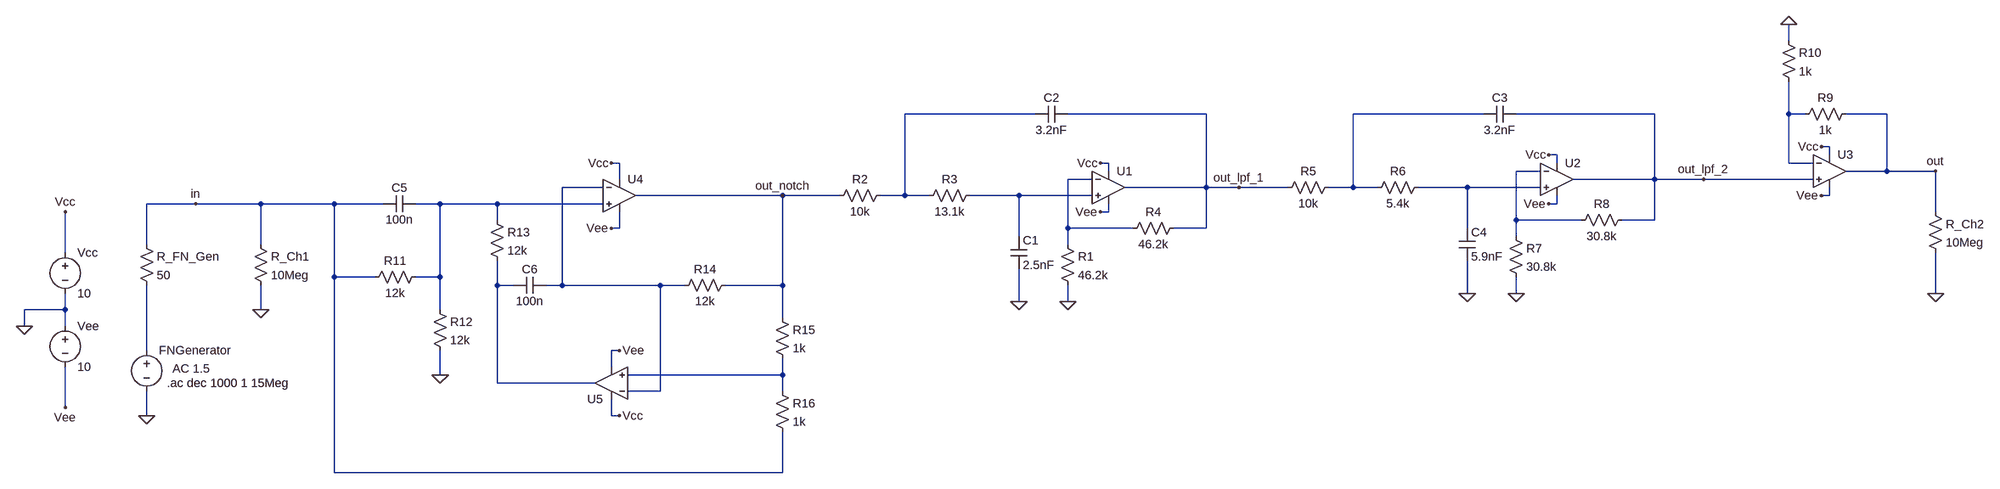
[diagram p0: schematic Mic-Filter.asc]
Mic-Filter.asc, the LTspice schematic file:
Version 4
SHEET 1 2580 680
WIRE 2192 -176 2192 -208
WIRE 656 -32 400 -32
WIRE 992 -32 720 -32
WIRE 1536 -32 1280 -32
WIRE 1872 -32 1600 -32
WIRE 2192 -32 2192 -96
WIRE 2224 -32 2192 -32
WIRE 2384 -32 2304 -32
WIRE 2272 32 2256 32
WIRE 1680 48 1664 48
WIRE 2272 48 2272 32
WIRE -160 64 -176 64
WIRE 800 64 784 64
WIRE 1680 64 1680 48
WIRE 2192 64 2192 -32
WIRE 2240 64 2192 64
WIRE 800 80 800 64
WIRE 1648 80 1600 80
WIRE 2384 80 2384 -32
WIRE 2384 80 2304 80
WIRE 2480 80 2384 80
WIRE -160 96 -160 64
WIRE 768 96 720 96
WIRE 1872 96 1872 -32
WIRE 1872 96 1712 96
WIRE 1968 96 1872 96
WIRE 2240 96 1968 96
WIRE -192 112 -272 112
WIRE 992 112 992 -32
WIRE 992 112 832 112
WIRE 1056 112 992 112
WIRE 1152 112 1056 112
WIRE 1280 112 1280 -32
WIRE 1280 112 1232 112
WIRE 1328 112 1280 112
WIRE 1504 112 1408 112
WIRE 1648 112 1504 112
WIRE 160 128 -128 128
WIRE 272 128 160 128
WIRE 400 128 400 -32
WIRE 400 128 352 128
WIRE 448 128 400 128
WIRE 624 128 528 128
WIRE 768 128 624 128
WIRE 2272 128 2272 112
WIRE 2272 128 2256 128
WIRE -992 144 -1088 144
WIRE -864 144 -992 144
WIRE -720 144 -864 144
WIRE -624 144 -720 144
WIRE -512 144 -560 144
WIRE -400 144 -512 144
WIRE -192 144 -400 144
WIRE 1680 144 1680 128
WIRE 1680 144 1664 144
WIRE 800 160 800 144
WIRE 800 160 784 160
WIRE 2480 160 2480 80
WIRE -400 176 -400 144
WIRE 1600 176 1600 80
WIRE 1728 176 1600 176
WIRE 1872 176 1872 96
WIRE 1872 176 1808 176
WIRE -160 192 -160 160
WIRE -160 192 -176 192
WIRE 720 192 720 96
WIRE 848 192 720 192
WIRE 992 192 992 112
WIRE 992 192 928 192
WIRE 1504 192 1504 112
WIRE 624 208 624 128
WIRE 1600 208 1600 176
WIRE -1088 224 -1088 144
WIRE -864 224 -864 144
WIRE 720 224 720 192
WIRE -1248 240 -1248 160
WIRE -720 288 -720 144
WIRE -640 288 -720 288
WIRE -512 288 -512 144
WIRE -512 288 -560 288
WIRE -400 304 -400 256
WIRE -368 304 -400 304
WIRE -272 304 -272 112
WIRE -272 304 -304 304
WIRE -80 304 -272 304
WIRE -32 304 -80 304
WIRE 160 304 160 128
WIRE 160 304 48 304
WIRE 1504 320 1504 256
WIRE 1600 320 1600 288
WIRE 2480 320 2480 240
WIRE 624 336 624 272
WIRE 720 336 720 304
WIRE -1248 352 -1248 320
WIRE -1248 352 -1328 352
WIRE -864 352 -864 304
WIRE -512 352 -512 288
WIRE 160 368 160 304
WIRE -1328 384 -1328 352
WIRE -1248 384 -1248 352
WIRE -1088 432 -1088 304
WIRE -160 432 -176 432
WIRE -176 464 -176 432
WIRE -512 480 -512 432
WIRE 160 480 160 448
WIRE 160 480 -144 480
WIRE -400 496 -400 304
WIRE -208 496 -400 496
WIRE -80 512 -80 304
WIRE -80 512 -144 512
WIRE 160 512 160 480
WIRE -1248 544 -1248 464
WIRE -1088 560 -1088 512
WIRE -176 560 -176 528
WIRE -160 560 -176 560
WIRE -720 672 -720 288
WIRE 160 672 160 592
WIRE 160 672 -720 672
FLAG -1088 560 0
FLAG -864 352 0
FLAG -992 144 in
FLAG 624 336 0
FLAG 720 336 0
FLAG -1328 384 0
FLAG -1248 544 Vee
FLAG -1248 160 Vcc
FLAG 784 160 Vee
FLAG 784 64 Vcc
FLAG 1056 112 out_lpf_1
FLAG 1600 320 0
FLAG 1664 144 Vee
FLAG 1664 48 Vcc
FLAG 1504 320 0
FLAG 1968 96 out_lpf_2
FLAG 2256 128 Vee
FLAG 2256 32 Vcc
FLAG 2480 320 0
FLAG 2192 -208 0
FLAG 2480 80 out
FLAG -512 480 0
FLAG -176 64 Vcc
FLAG -176 192 Vee
FLAG -160 560 Vcc
FLAG -160 432 Vee
FLAG 160 128 out_notch
SYMBOL res -1104 208 R0
SYMATTR InstName R_FN_Gen
SYMATTR Value 50
SYMBOL voltage -1088 416 R0
WINDOW 123 51 52 Left 2
WINDOW 39 0 0 Left 0
SYMATTR Value2 AC 1.5
SYMATTR InstName FNGenerator
SYMATTR Value ""
SYMBOL res -880 208 R0
SYMATTR InstName R_Ch1
SYMATTR Value 10Meg
SYMBOL res 368 112 R90
WINDOW 0 0 56 VBottom 2
WINDOW 3 32 56 VTop 2
SYMATTR InstName R2
SYMATTR Value 10k
SYMBOL res 544 112 R90
WINDOW 0 0 56 VBottom 2
WINDOW 3 32 56 VTop 2
SYMATTR InstName R3
SYMATTR Value 13.1k
SYMBOL OpAmps\\UniversalOpamp2 800 112 R0
SYMATTR InstName U1
SYMBOL cap 608 208 R0
SYMATTR InstName C1
SYMATTR Value 2.5nF
SYMBOL cap 720 -48 R90
WINDOW 0 0 32 VBottom 2
WINDOW 3 32 32 VTop 2
SYMATTR InstName C2
SYMATTR Value 3.2nF
SYMBOL res 704 208 R0
SYMATTR InstName R1
SYMATTR Value 46.2k
SYMBOL voltage -1248 368 R0
WINDOW 123 0 0 Left 0
WINDOW 39 0 0 Left 0
SYMATTR InstName Vee
SYMATTR Value 10
SYMBOL res 944 176 R90
WINDOW 0 0 56 VBottom 2
WINDOW 3 32 56 VTop 2
SYMATTR InstName R4
SYMATTR Value 46.2k
SYMBOL res 1248 96 R90
WINDOW 0 0 56 VBottom 2
WINDOW 3 32 56 VTop 2
SYMATTR InstName R5
SYMATTR Value 10k
SYMBOL res 1424 96 R90
WINDOW 0 0 56 VBottom 2
WINDOW 3 32 56 VTop 2
SYMATTR InstName R6
SYMATTR Value 5.4k
SYMBOL cap 1600 -48 R90
WINDOW 0 0 32 VBottom 2
WINDOW 3 32 32 VTop 2
SYMATTR InstName C3
SYMATTR Value 3.2nF
SYMBOL OpAmps\\UniversalOpamp2 1680 96 R0
SYMATTR InstName U2
SYMBOL res 1584 192 R0
SYMATTR InstName R7
SYMATTR Value 30.8k
SYMBOL res 1824 160 R90
WINDOW 0 0 56 VBottom 2
WINDOW 3 32 56 VTop 2
SYMATTR InstName R8
SYMATTR Value 30.8k
SYMBOL cap 1488 192 R0
SYMATTR InstName C4
SYMATTR Value 5.9nF
SYMBOL OpAmps\\UniversalOpamp2 2272 80 R0
SYMATTR InstName U3
SYMBOL res 2320 -48 R90
WINDOW 0 0 56 VBottom 2
WINDOW 3 32 56 VTop 2
SYMATTR InstName R9
SYMATTR Value 1k
SYMBOL res 2176 -192 R0
SYMATTR InstName R10
SYMATTR Value 1k
SYMBOL res 2464 144 R0
SYMATTR InstName R_Ch2
SYMATTR Value 10Meg
SYMBOL voltage -1248 224 R0
SYMATTR InstName Vcc
SYMATTR Value 10
SYMBOL cap -560 128 R90
WINDOW 0 0 32 VBottom 2
WINDOW 3 32 32 VTop 2
SYMATTR InstName C5
SYMATTR Value 100n
SYMBOL res -544 272 R90
WINDOW 0 0 56 VBottom 2
WINDOW 3 32 56 VTop 2
SYMATTR InstName R11
SYMATTR Value 12k
SYMBOL res -528 336 R0
SYMATTR InstName R12
SYMATTR Value 12k
SYMBOL res -416 160 R0
SYMATTR InstName R13
SYMATTR Value 12k
SYMBOL OpAmps\\UniversalOpamp2 -160 128 R0
SYMATTR InstName U4
SYMBOL res 64 288 R90
WINDOW 0 0 56 VBottom 2
WINDOW 3 32 56 VTop 2
SYMATTR InstName R14
SYMATTR Value 12k
SYMBOL res 144 352 R0
SYMATTR InstName R15
SYMATTR Value 1k
SYMBOL res 144 496 R0
SYMATTR InstName R16
SYMATTR Value 1k
SYMBOL cap -304 288 R90
WINDOW 0 0 32 VBottom 2
WINDOW 3 32 32 VTop 2
SYMATTR InstName C6
SYMATTR Value 100n
SYMBOL OpAmps\\UniversalOpamp2 -176 496 R180
SYMATTR InstName U5
TEXT -1048 496 Left 2 !.ac dec 1000 1 15Meg

The netlist it stands for:
* Mic-Filter.asc
R_FN_Gen in N011 50
V§FNGenerator N011 0 AC 1.5
R_Ch1 in 0 10Meg
R2 N001 out_notch 10k
R3 N008 N001 13.1k
XU1 N008 N005 Vcc Vee out_lpf_1 level.2 Avol=1Meg GBW=10Meg Slew=10Meg ilimit=25m rail=0 Vos=0 phimargin=45 en=0 enk=0 in=0 ink=0 Rin=500Meg  ; pins IN+ IN- V+ V- OUT
C1 N008 0 2.5nF
C2 out_lpf_1 N001 3.2nF
R1 N005 0 46.2k
Vee 0 Vee 10
R4 out_lpf_1 N005 46.2k
R5 N002 out_lpf_1 10k
R6 N007 N002 5.4k
C3 out_lpf_2 N002 3.2nF
XU2 N007 N004 Vcc Vee out_lpf_2 level.2 Avol=1Meg GBW=10Meg Slew=10Meg ilimit=25m rail=0 Vos=0 phimargin=45 en=0 enk=0 in=0 ink=0 Rin=500Meg  ; pins IN+ IN- V+ V- OUT
R7 N004 0 30.8k
R8 out_lpf_2 N004 30.8k
C4 N007 0 5.9nF
XU3 out_lpf_2 N003 Vcc Vee out level.2 Avol=1Meg GBW=10Meg Slew=10Meg ilimit=25m rail=0 Vos=0 phimargin=45 en=0 enk=0 in=0 ink=0 Rin=500Meg  ; pins IN+ IN- V+ V- OUT
R9 out N003 1k
R10 0 N003 1k
R_Ch2 out 0 10Meg
Vcc Vcc 0 10
C5 N009 in 100n
R11 N009 in 12k
R12 N009 0 12k
R13 N009 N010 12k
XU4 N009 N006 Vcc Vee out_notch level.2 Avol=1Meg GBW=10Meg Slew=10Meg ilimit=25m rail=0 Vos=0 phimargin=45 en=0 enk=0 in=0 ink=0 Rin=500Meg  ; pins IN+ IN- V+ V- OUT
R14 out_notch N006 12k
R15 out_notch N012 1k
R16 N012 in 1k
C6 N006 N010 100n
XU5 N012 N006 Vcc Vee N010 level.2 Avol=1Meg GBW=10Meg Slew=10Meg ilimit=25m rail=0 Vos=0 phimargin=45 en=0 enk=0 in=0 ink=0 Rin=500Meg  ; pins IN+ IN- V+ V- OUT
.ac dec 1000 1 15Meg
.lib UniversalOpamps2.sub
.backanno
.end